# EasyEDA Pro project F405飞控工程文件（20250418）.epro, schematic Schematic1
Board Name: Board1; Create Date: 2024-08-31; Page Name: P1; Project Name: 低成本F405飞控; Schematic Name: Schematic1; Update Date: 2024-10-12; Company: 嘉立创EDA; Page Size: A4; Version: V1.0
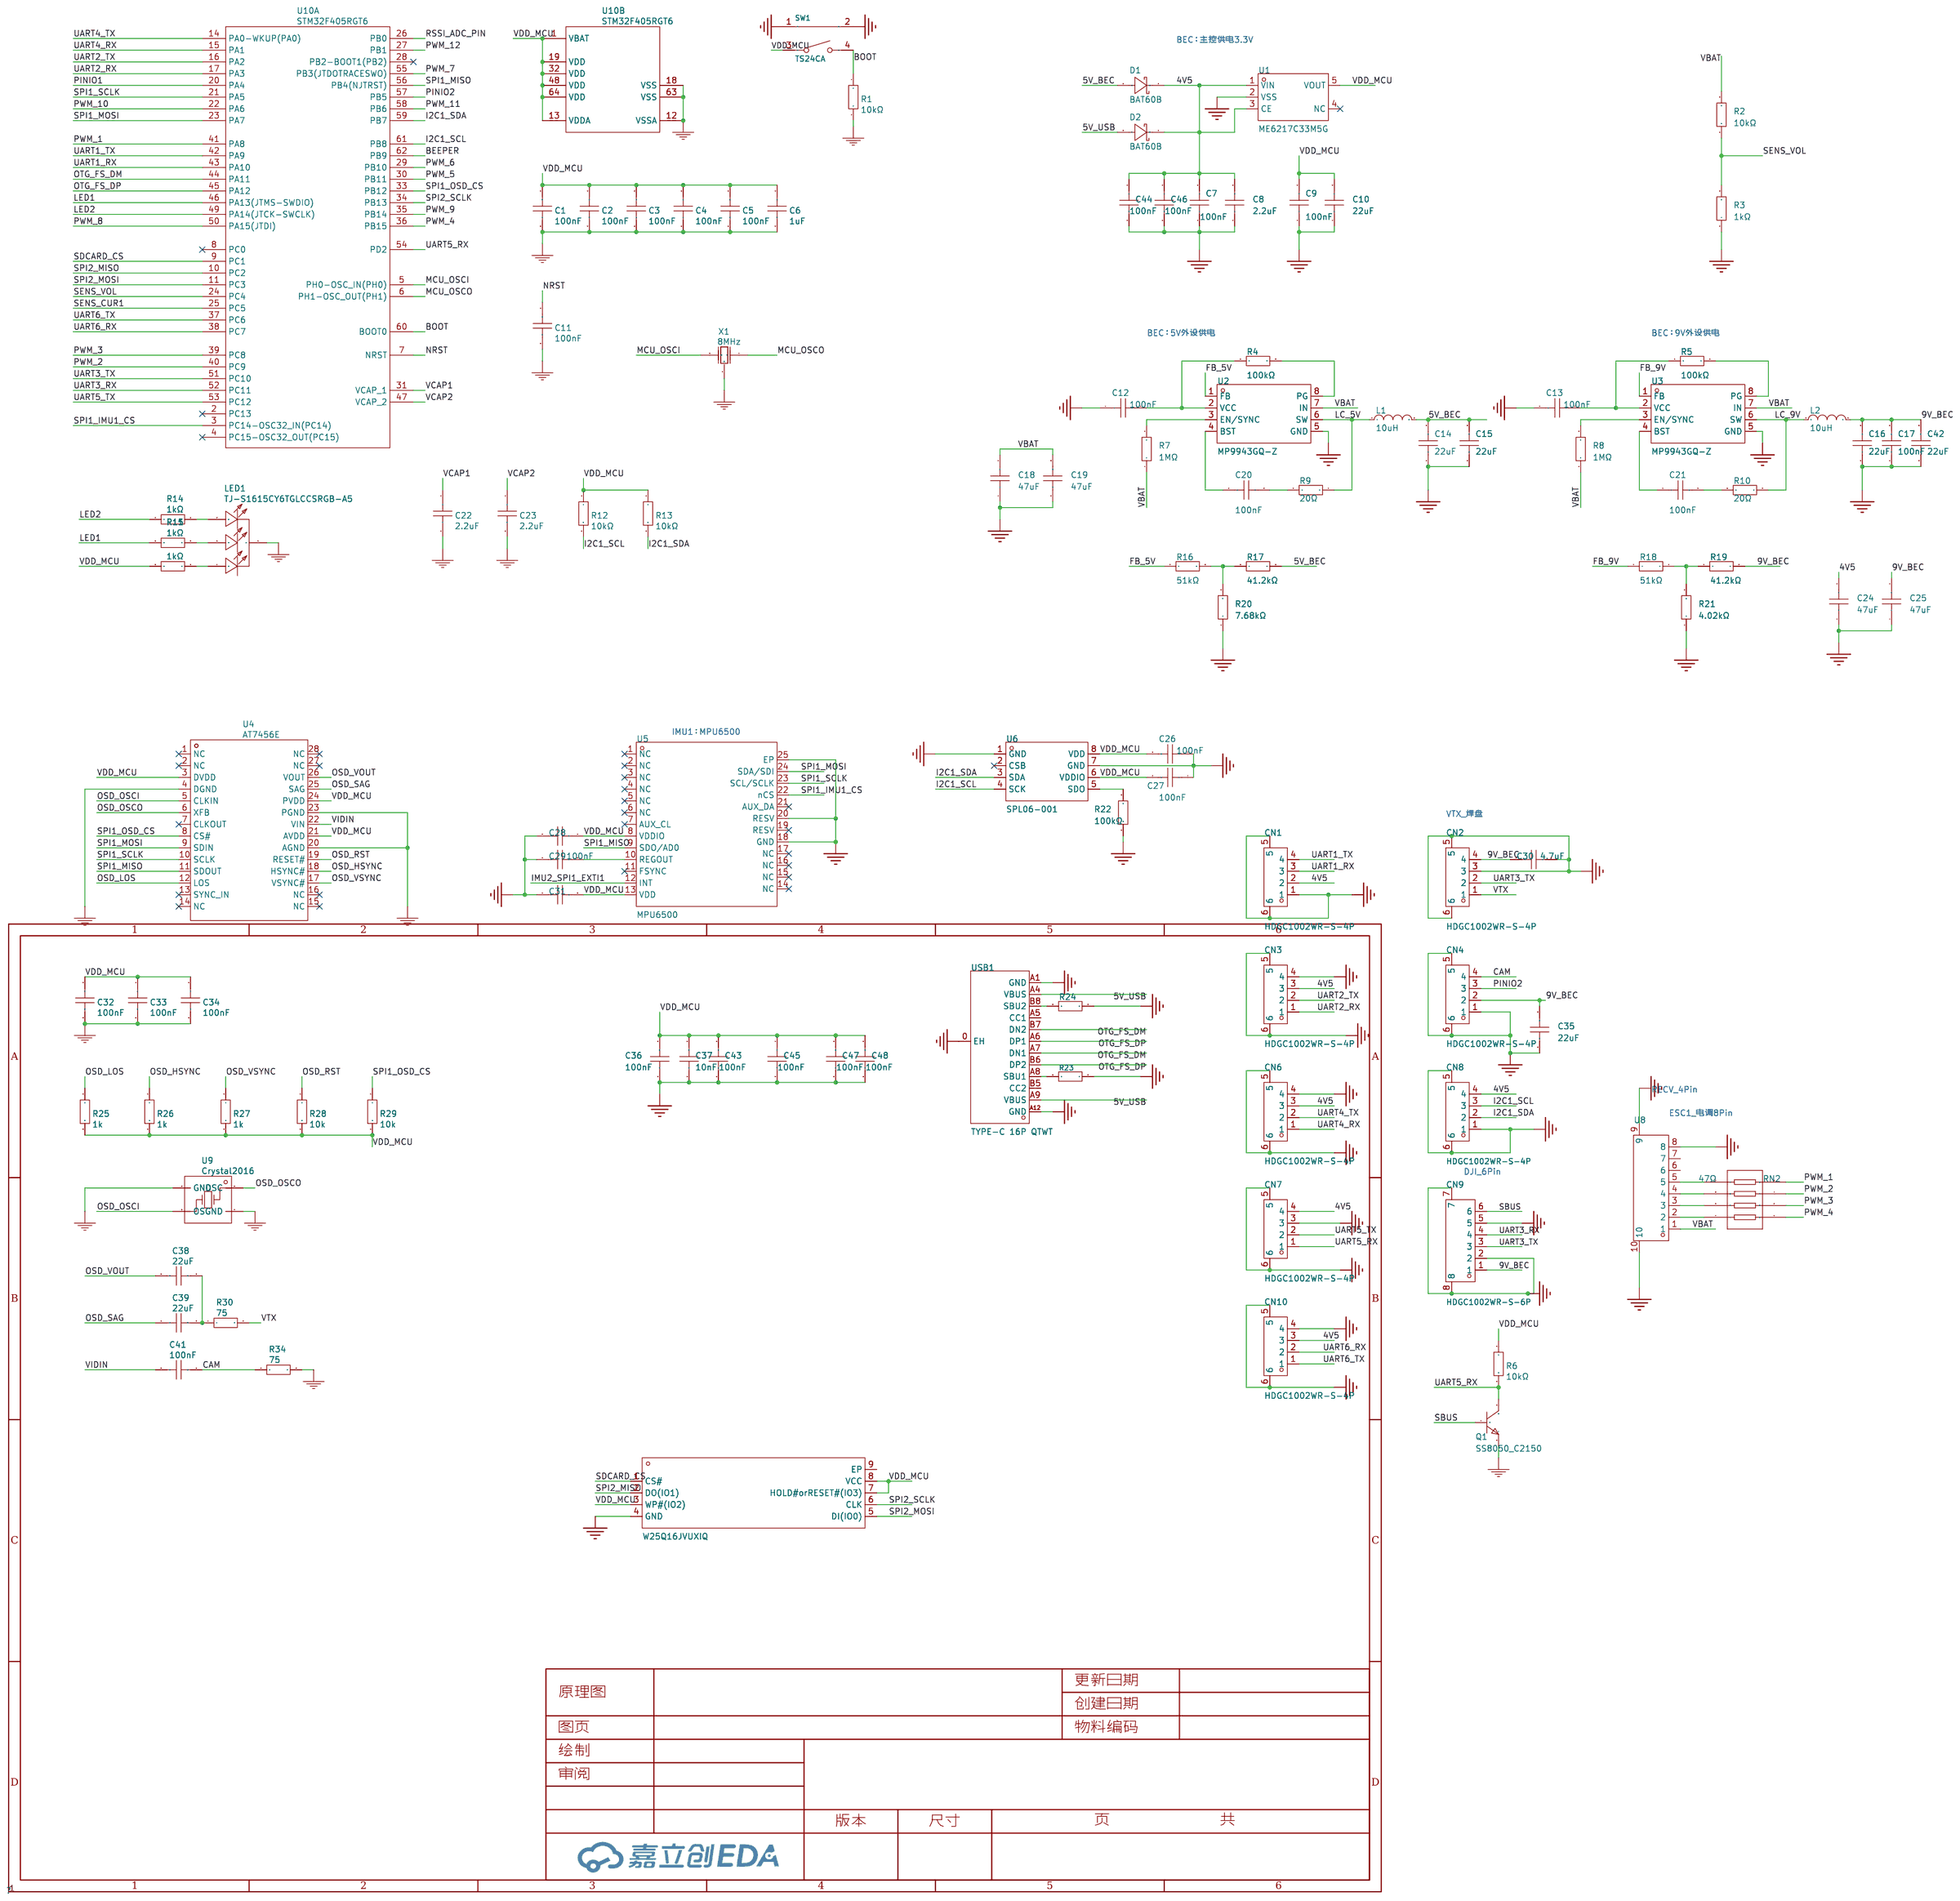
[diagram p0: schematic sheet]

## Parts
C1  100nF  [R0402]
C2  100nF  [R0402]
C3  100nF  [R0402]
C4  100nF  [R0402]
C5  100nF  [R0402]
C6  1uF  [R0402]
C7  100nF  [R0402]
C8  2.2uF  [R0402]
C9  100nF  [C0603]
C10  22uF  [C0603]
C11  100nF  [R0402]
C12  100nF  [C0402]
C13  100nF  [C0402]
C14  22uF  [C0603]
C15  22uF  [C0603]
C16  22uF  [C0603]
C17  100nF  [C0603]
C18  47uF  [C1206]
C19  47uF  [C1206]
C20  100nF  [C0402]
C21  100nF  [C0402]
C22  2.2uF  [R0402]
C23  2.2uF  [R0402]
C24  47uF  [C1206]
C25  47uF  [C1206]
C26  100nF  [C0402]
C27  100nF  [C0402]
C28  100nF  [C0402]
C29  100nF  [C0402]
C30  4.7uF  [C0603]
C31  100nF  [C0402]
C32  100nF  [C0402]
C33  100nF  [C0402]
C34  100nF  [C0402]
C35  22uF  [C0805]
C36  100nF  [C0402]
C37  10nF  [C0402]
C38  22uF  [C0402]
C39  22uF  [C0402]
C41  100nF  [C0402]
C42  22uF  [C0603]
C43  100nF  [R0402]
C44  100nF  [R0402]
C45  100nF  [R0402]
C46  100nF  [R0402]
C47  100nF  [R0402]
C48  100nF  [R0402]
CN1  HDGC1002WR-S-4P  [CONN-SMD_4P-P1.00_HDGC_HDGC1002WR-S-4P]
CN2  HDGC1002WR-S-4P  [CONN-SMD_4P-P1.00_HDGC_HDGC1002WR-S-4P]
CN3  HDGC1002WR-S-4P  [CONN-SMD_4P-P1.00_HDGC_HDGC1002WR-S-4P]
CN4  HDGC1002WR-S-4P  [CONN-SMD_4P-P1.00_HDGC_HDGC1002WR-S-4P]
CN6  HDGC1002WR-S-4P  [CONN-SMD_4P-P1.00_HDGC_HDGC1002WR-S-4P]
CN7  HDGC1002WR-S-4P  [CONN-SMD_4P-P1.00_HDGC_HDGC1002WR-S-4P]
CN8  HDGC1002WR-S-4P  [CONN-SMD_4P-P1.00_HDGC_HDGC1002WR-S-4P]
CN9  HDGC1002WR-S-6P  [CONN-SMD_6P-P1.00_HDGC1002WR-S-6P]
CN10  HDGC1002WR-S-4P  [CONN-SMD_4P-P1.00_HDGC_HDGC1002WR-S-4P]
D1  BAT60B  [SOD-323_L1.7-W1.3-LS2.6-RD-1]
D2  BAT60B  [SOD-323_L1.7-W1.3-LS2.6-RD-1]
L1  10uH  [IND-SMD_L4.4-W4.2]
L2  10uH  [IND-SMD_L4.4-W4.2]
LED1  TJ-S1615CY6TGLCCSRGB-A5  [LED-ARRAY-SMD_4P-L1.6-W1.5-BL-FD]
Q1  SS8050_C2150  [SOT-23-3_L2.9-W1.3-P1.90-LS2.4-BR]
R1  10kΩ  [R0402]
R2  10kΩ  [R0402]
R3  1kΩ  [R0402]
R4  100kΩ  [R0402]
R5  100kΩ  [R0402]
R6  10kΩ  [R0402]
R7  1MΩ  [R0402]
R8  1MΩ  [R0402]
R9  20Ω  [R0402]
R10  20Ω  [R0402]
R11  1kΩ  [R0402]
R12  10kΩ  [R0402]
R13  10kΩ  [R0402]
R14  1kΩ  [R0402]
R15  1kΩ  [R0402]
R16  51kΩ  [R0402]
R17  41.2kΩ  [R0402]
R18  51kΩ  [R0402]
R19  41.2kΩ  [R0402]
R20  7.68kΩ  [R0402]
R21  4.02kΩ  [R0402]
R22  100kΩ  [R0402]
R23  5.1kΩ  [R0402]
R24  5.1kΩ  [R0402]
R25  1k  [R0402]
R26  1k  [R0402]
R27  1k  [R0402]
R28  10k  [R0402]
R29  10k  [R0402]
R30  75  [R0402]
R34  75  [R0402]
RN2  47Ω  [RES-ARRAY-SMD_0402-8P-L2.0-W1.0-BL]
SW1  TS24CA  [SW-SMD_TS24CA]
U1  ME6217C33M5G  [SOT-23-5_L3.0-W1.7-P0.95-LS2.8-BR]
U2  MP9943GQ-Z  [QFN-8_L3.0-W3.0-P0.65-BL]
U3  MP9943GQ-Z  [QFN-8_L3.0-W3.0-P0.65-BL]
U4  AT7456E  [AT7456E-SHORTER-FOOTPRINT]
U5  MPU6500  [QFN-24_L3.0-W3.0-P0.40-BL-EP]
U6  SPL06-001  [SENSOR-SMD_SPL06-001]
U8  HDGC1002WR-S-8P  [CONN-SMD_8P-P1.00_HDGC_HDGC1002WR-S-8P]
U9  Crystal2016  [CRYSTAL2016]
U10  STM32F405RGT6  [LQFP-64_L10.0-W10.0-P0.50-LS12.0-BL]  (sections 1,2)
U11  W25Q16JVUXIQ  [USON-8_L3.0-W2.0-P0.50-BL-EP]
USB1  TYPE-C 16P QTWT  [USB-TYPE-C-SMD_TYPE-C-16P-QTWT]
X1  8MHz  [OSC-SMD_3P-L3.2-W1.3-P1.20-L]

## Library data of the parts
C1-C5 C11 C43-C48 = GRM155R71H104KE14D: 容值:100nF;精度:±10%;额定电压:50V;材质(温度系数):X7R;; LCSC Part Name: 100nF ±10% 50V; Supplier Part: C77020; Manufacturer: muRata(村田); Supplier Footprint: 0402; JLCPCB Part Class: Extended Part; Datasheet: https://atta.szlcsc.com/upload/public/pdf/source/20180326/C77020_39BD49C951FF1AF0DB1F1FAC5AC1E401.pdf; Supplier: LCSC; Tolerance: ±10%; Voltage Rated: 50V; Temperature Coefficient: X7R; 3DModel: C0402_L1.0-W0.5-H0.5
C6 = GRM155R61H105KE05D: 容值:1uF;精度:±10%;额定电压:50V;材质(温度系数):X5R;; LCSC Part Name: 1uF ±10% 50V; Supplier Part: C1518208; Manufacturer: muRata(村田); Supplier Footprint: 0402; JLCPCB Part Class: Extended Part; Datasheet: https://atta.szlcsc.com/upload/public/pdf/source/20210607/3F03D47137F6EC7729AB4067EB2A6EB3.pdf; Supplier: LCSC; Tolerance: ±10%; Voltage Rated: 50V; Temperature Coefficient: X5R; 3DModel: C0402_L1.0-W0.5-H0.5
C7 C12 C13 C20 C21 C26 C27 C29 C36 = GRM155R71H104KE14D: 容值:100nF;精度:±10%;额定电压:50V;材质(温度系数):X7R;; LCSC Part Name: 100nF ±10% 50V; Supplier Part: C77020; Manufacturer: muRata(村田); Supplier Footprint: 0402; JLCPCB Part Class: Extended Part; Datasheet: https://atta.szlcsc.com/upload/public/pdf/source/20180326/C77020_39BD49C951FF1AF0DB1F1FAC5AC1E401.pdf; Supplier: LCSC; Tolerance: ±10%; Voltage Rated: 50V; Temperature Coefficient: X7R
C8 = CGA0402X5R225K350GT: 容值:2.2uF;精度:±10%;额定电压:35V;材质(温度系数):X5R;; LCSC Part Name: 2.2uF ±10% 35V; Supplier Part: C6119793; Manufacturer: HRE(芯声); Supplier Footprint: 0402; JLCPCB Part Class: Extended Part; Datasheet: https://atta.szlcsc.com/upload/public/pdf/source/20160218/1457707763339.pdf; Supplier: LCSC; Tolerance: ±10%; Voltage Rated: 35V; Temperature Coefficient: X5R
C9 C17 = 0603B104K500NT: 容值:100nF;精度:±10%;额定电压:50V;材质(温度系数):X7R;; LCSC Part Name: 100nF ±10% 50V; Supplier Part: C30926; Manufacturer: FH(风华); Supplier Footprint: 0603; JLCPCB Part Class: Extended Part; Datasheet: https://atta.szlcsc.com/upload/public/pdf/source/20200305/C486355_26A10D38EF8C2A5C37091D0039909270.pdf; Supplier: LCSC; Tolerance: ±10%; Voltage Rated: 50V; Temperature Coefficient: X7R
C10 C14-C16 C42 = CL10A226MQ8NRNC: 容值:22uF;精度:±20%;额定电压:6.3V;材质(温度系数):X5R;; LCSC Part Name: 22uF ±20% 6.3V; Supplier Part: C59461; Manufacturer: SAMSUNG(三星); Supplier Footprint: 0603; JLCPCB Part Class: Basic Part; Datasheet: https://atta.szlcsc.com/upload/public/pdf/source/20160218/1457707763339.pdf; Supplier: LCSC; Tolerance: ±20%; Voltage Rated: 6.3V; Temperature Coefficient: X5R
C18 C19 C24 C25 = CL31A476MPHNNNE: 容值:47uF;精度:±20%;额定电压:10V;材质(温度系数):X5R;; LCSC Part Name: 47uF ±20% 10V; Supplier Part: C96123; Manufacturer: SAMSUNG(三星); Supplier Footprint: 1206; JLCPCB Part Class: Basic Part; Datasheet: https://atta.szlcsc.com/upload/public/pdf/source/20170228/1488267692219.pdf; Supplier: LCSC; Tolerance: ±20%; Voltage Rated: 10V; Temperature Coefficient: X5R
C22 C23 = CGA0402X5R225K350GT: 容值:2.2uF;精度:±10%;额定电压:35V;材质(温度系数):X5R;; LCSC Part Name: 2.2uF ±10% 35V; Supplier Part: C6119793; Manufacturer: HRE(芯声); Supplier Footprint: 0402; JLCPCB Part Class: Extended Part; Supplier: LCSC; Tolerance: ±10%; Voltage Rated: 35V; Temperature Coefficient: X5R; 3DModel: C0402_L1.0-W0.5-H0.5
C28 C31 = GRM155R71H104KE14D: 容值:100nF;精度:±10%;额定电压:50V;材质(温度系数):X7R;; LCSC Part Name: 100nF ±10% 50V; Supplier Part: C77020; Manufacturer: muRata(村田); Supplier Footprint: 0402; JLCPCB Part Class: Extended Part; Datasheet: https://atta.szlcsc.com/upload/public/pdf/source/20180326/C77020_39BD49C951FF1AF0DB1F1FAC5AC1E401.pdf; Supplier: LCSC; Tolerance: ±10%; Voltage Rated: 50V; Temperature Coefficient: X7R; link: https://item.szlcsc.com/15869.html; 3DModel: C0402_L1.0-W0.5-H0.5
C30 = CAP_0603: Supplier Footprint: 0603
C32-C34 C41 = 100nF: 3DModel: C0402_L1.0-W0.5-H0.5
C35 = CL21A226MAYNNNE: 容值:22uF;精度:±20%;额定电压:25V;材质(温度系数):X5R;; LCSC Part Name: 22uF ±20% 25V; Supplier Part: C602037; Manufacturer: SAMSUNG(三星); Supplier Footprint: 0805; JLCPCB Part Class: Extended Part; Datasheet: https://atta.szlcsc.com/upload/public/pdf/source/20200609/C602037_1A0D619693E608A1BF6E80154254E2DB.pdf; Supplier: LCSC; Tolerance: ±20%; Voltage Rated: 25V; Temperature Coefficient: X5R; Origin Footprint 2: 0805C
C37 = CC0402KRX7R9BB103: 容值:10nF;精度:±10%;额定电压:50V;材质(温度系数):X7R;; LCSC Part Name: 10nF ±10% 50V; Supplier Part: C60133; Manufacturer: YAGEO(国巨); Supplier Footprint: 0402; JLCPCB Part Class: Extended Part; Datasheet: https://atta.szlcsc.com/upload/public/pdf/source/20180224/C181747_15194369449651363981.pdf; Supplier: LCSC; Tolerance: ±10%; Voltage Rated: 50V; Temperature Coefficient: X7R
C38 C39 = CGA0402X5R226M100GT: 容值:22uF;精度:±20%;额定电压:10V;材质(温度系数):X5R;; LCSC Part Name: 22uF ±20% 10V; Supplier Part: C6119813; Manufacturer: HRE(芯声); Supplier Footprint: 0402; JLCPCB Part Class: Extended Part; Supplier: LCSC; Tolerance: ±20%; Voltage Rated: 10V; Temperature Coefficient: X5R; 3DModel: C0603_L1.6-W0.8-H0.8
CN1-CN4 CN6-CN8 CN10 = HDGC1002WR-S-4P: SH1.0针座卧贴 4P; LCSC Part Name: SH1.0针座卧贴 4P; Supplier Part: C2936214; Manufacturer: HDGC(华德共创); Supplier Footprint: SMD,P=1mm; JLCPCB Part Class: 扩展库; Datasheet: https://atta.szlcsc.com/upload/public/pdf/source/20211229/E8A09E85670B5E97244D2008A24D97FE.pdf; Supplier: LCSC
CN9 = HDGC1002WR-S-6P: 参考系列:SH;间距:1mm;排数:1;每排PIN数:6;公母:公型插针;安装方式:卧贴;额定电流:1A;工作温度范围:-40℃~+85℃;; LCSC Part Name: SH 1mm 卧贴; Supplier Part: C3041141; Manufacturer: HDGC(华德共创); Supplier Footprint: SMD,P=1mm; JLCPCB Part Class: 扩展库; Datasheet: https://atta.szlcsc.com/upload/public/pdf/source/20220621/C2AA6A1A2A279F73FC0521BA202CB6E2.pdf; Supplier: LCSC; Reference Series: SH; Pitch: 1mm; Number of Rows: 1; Number of PINs Per Row: 6; Gender: 公型插针; Mounting Style: 卧贴; Current Rating (Max): 1A; Operating Temperature Range: -40℃~+85℃
D1 = BAT60B_C7502695: 二极管配置:独立式;正向压降(Vf):600mV@1A;直流反向耐压(Vr):10V;整流电流:3A;; LCSC Part Name: 电压:10V 电流:3A; Supplier Part: C7502695; Manufacturer: 宏迦橙; Supplier Footprint: SOD-323; JLCPCB Part Class: Extended Part; Datasheet: https://atta.szlcsc.com/upload/public/pdf/source/20230828/25AE167151E881636AF68D9C9ECB5F9C.pdf; Supplier: LCSC; Diode Configuration: 独立式; Forward Voltage (Vf@If): 600mV@1A; Reverse Voltage (Vr): 10V; Rectified Current: 3A; Reverse Leakage Current (Ir): 25uA
D2 = BAT60B_C7502695: 二极管配置:独立式;正向压降(Vf):600mV@1A;直流反向耐压(Vr):10V;整流电流:3A;; LCSC Part Name: 电压:10V 电流:3A; Supplier Part: C7502695; Manufacturer: 宏迦橙; Supplier Footprint: SOD-323; JLCPCB Part Class: Extended Part; Datasheet: https://atta.szlcsc.com/upload/public/pdf/source/20230828/25AE167151E881636AF68D9C9ECB5F9C.pdf; Supplier: LCSC; Diode Configuration: 独立式; Forward Voltage (Vf@If): 600mV@1A; Reverse Voltage (Vr): 10V; Rectified Current: 3A; Reverse Leakage Current (Ir): 25uA; Average Rectified Current (Io): 3A
L1 L2 = FXL0420-100-M: 电感值:10uH;精度:±20%;额定电流:1.6A;饱和电流(Isat):2.2A;类型:一体成型电感;; LCSC Part Name: 10uH ±20% 2.2A; Supplier Part: C177242; Manufacturer: cjiang(长江微电); Supplier Footprint: SMD,4.2x4.4mm; JLCPCB Part Class: Extended Part; Datasheet: https://atta.szlcsc.com/upload/public/pdf/source/20200117/C485363_A2440626DC7482D75DD0DD56D1883FBF.pdf; Supplier: LCSC; Tolerance: ±20%; Rated Current: 1.6A; Saturation Current (Isat): 2.2A; DC Resistance (DCR): 282mΩ; Type: 一体成型电感
LED1 = TJ-S1615CY6TGLCCSRGB-A5: link: https://item.szlcsc.com/261955.html; 3DModel: LED-ARRAY-SMD_4P-L1.6-W1.5-H0.6-BL-FD; Supplier: LCSC; Supplier Part: C601684; Manufacturer: TOGIALED; JLCPCB Part Class: Extended Part
Q1 = SS8050_C2150: link: https://www.diodes.com/assets/Package-Files/SOT23.pdf; 3DModel: SOT-23-3P_L2.9-W1.3-H1.0-LS2.4-P0.95; Supplier: LCSC; Manufacturer: CJ; Manufacturer Part: SS8050; Supplier Part: C2150; JLCPCB Part Class: Basic Part
R1 R6 R12 R13 = RC0402FR-0710KL: 电阻类型:厚膜电阻;阻值:10kΩ;精度:±1%;功率:62.5mW;最大工作电压:50V;温度系数:±100ppm/℃;; LCSC Part Name: 厚膜电阻 10kΩ ±1% 62.5mW; Supplier Part: C60490; Manufacturer: YAGEO(国巨); Supplier Footprint: 0402; JLCPCB Part Class: Extended Part; Datasheet: https://atta.szlcsc.com/upload/public/pdf/source/20170925/C131467_1506321478108990263.pdf; Supplier: LCSC; Type: 厚膜电阻; Tolerance: ±1%; Power(Watts): 62.5mW; Overload Voltage (Max): 50V; Temperature Coefficient: ±100ppm/℃; Operating Temperature Range: -55℃~+155℃; 3DModel: R0402_L1.0-W0.5-H0.4
R2 = RC0402FR-0710KL: 电阻类型:厚膜电阻;阻值:10kΩ;精度:±1%;功率:62.5mW;最大工作电压:50V;温度系数:±100ppm/℃;; LCSC Part Name: 厚膜电阻 10kΩ ±1% 62.5mW; Supplier Part: C60490; Manufacturer: YAGEO(国巨); Supplier Footprint: 0402; JLCPCB Part Class: Extended Part; Datasheet: https://atta.szlcsc.com/upload/public/pdf/source/20170925/C131467_1506321478108990263.pdf; Supplier: LCSC; Type: 厚膜电阻; Tolerance: ±1%; Power(Watts): 62.5mW; Overload Voltage (Max): 50V; Temperature Coefficient: ±100ppm/℃; Operating Temperature Range: -55℃~+155℃
R3 = 0402WGF1001TCE: 电阻类型:厚膜电阻;阻值:1kΩ;精度:±1%;功率:62.5mW;最大工作电压:50V;温度系数:±100ppm/℃;; LCSC Part Name: 1kΩ ±1% 62.5mW 厚膜电阻; Supplier Part: C11702; Manufacturer: UNI-ROYAL(厚声); Supplier Footprint: 0402; JLCPCB Part Class: Basic Part; Datasheet: https://atta.szlcsc.com/upload/public/pdf/source/20200306/C422600_1E6D84923E4A46A82E41ADD87F860B5C.pdf; Supplier: LCSC; Type: 厚膜电阻; Tolerance: ±1%; Power(Watts): 62.5mW; Overload Voltage (Max): 50V; Temperature Coefficient: ±100ppm/℃; Operating Temperature Range: -55℃~+155℃
R4 R5 R22 = RC0402FR-07100KL: 电阻类型:厚膜电阻;阻值:100kΩ;精度:±1%;功率:62.5mW;最大工作电压:50V;温度系数:±100ppm/℃;; LCSC Part Name: 厚膜电阻 100kΩ ±1% 62.5mW; Supplier Part: C60491; Manufacturer: YAGEO(国巨); Supplier Footprint: 0402; JLCPCB Part Class: Extended Part; Datasheet: https://atta.szlcsc.com/upload/public/pdf/source/20180927/C295883_E8D83085EA81BD7DE0B2B681138C15EE.pdf; Supplier: LCSC; Type: 厚膜电阻; Tolerance: ±1%; Power(Watts): 62.5mW; Overload Voltage (Max): 50V; Temperature Coefficient: ±100ppm/℃; Operating Temperature Range: -55℃~+155℃
R7 R8 = 0402WGF1004TCE: 电阻类型:厚膜电阻;阻值:1MΩ;精度:±1%;功率:62.5mW;最大工作电压:50V;温度系数:±100ppm/℃;; LCSC Part Name: 1MΩ ±1% 62.5mW 厚膜电阻; Supplier Part: C26083; Manufacturer: UNI-ROYAL(厚声); Supplier Footprint: 0402; JLCPCB Part Class: Basic Part; Datasheet: https://atta.szlcsc.com/upload/public/pdf/source/20200306/C422600_1E6D84923E4A46A82E41ADD87F860B5C.pdf; Supplier: LCSC; Type: 厚膜电阻; Tolerance: ±1%; Power(Watts): 62.5mW; Overload Voltage (Max): 50V; Temperature Coefficient: ±100ppm/℃; Operating Temperature Range: -55℃~+155℃
R9 R10 = 0402WGF200JTCE: 电阻类型:厚膜电阻;阻值:20Ω;精度:±1%;功率:62.5mW;最大工作电压:50V;温度系数:±200ppm/℃;; LCSC Part Name: 20Ω ±1% 62.5mW 厚膜电阻; Supplier Part: C25089; Manufacturer: UNI-ROYAL(厚声); Supplier Footprint: 0402; JLCPCB Part Class: Extended Part; Datasheet: https://atta.szlcsc.com/upload/public/pdf/source/20200306/C422600_1E6D84923E4A46A82E41ADD87F860B5C.pdf; Supplier: LCSC; Type: 厚膜电阻; Tolerance: ±1%; Power(Watts): 62.5mW; Overload Voltage (Max): 50V; Temperature Coefficient: ±200ppm/℃; Operating Temperature Range: -55℃~+155℃
R11 R14 R15 = 0402WGF1001TCE: 电阻类型:厚膜电阻;阻值:1kΩ;精度:±1%;功率:62.5mW;最大工作电压:50V;温度系数:±100ppm/℃;; LCSC Part Name: 1kΩ ±1% 62.5mW 厚膜电阻; Supplier Part: C11702; Manufacturer: UNI-ROYAL(厚声); Supplier Footprint: 0402; JLCPCB Part Class: Basic Part; Datasheet: https://atta.szlcsc.com/upload/public/pdf/source/20200306/C422600_1E6D84923E4A46A82E41ADD87F860B5C.pdf; Supplier: LCSC; Type: 厚膜电阻; Tolerance: ±1%; Power(Watts): 62.5mW; Overload Voltage (Max): 50V; Temperature Coefficient: ±100ppm/℃; Operating Temperature Range: -55℃~+155℃; 3DModel: R0402_L1.0-W0.5-H0.4
R16 R18 = 0402WGF5102TCE: 电阻类型:厚膜电阻;阻值:51kΩ;精度:±1%;功率:62.5mW;最大工作电压:50V;温度系数:±100ppm/℃;; LCSC Part Name: 51kΩ ±1% 62.5mW 厚膜电阻; Supplier Part: C25794; Manufacturer: UNI-ROYAL(厚声); Supplier Footprint: 0402; JLCPCB Part Class: Basic Part; Datasheet: https://atta.szlcsc.com/upload/public/pdf/source/20200306/C422600_1E6D84923E4A46A82E41ADD87F860B5C.pdf; Supplier: LCSC; Type: 厚膜电阻; Tolerance: ±1%; Power(Watts): 62.5mW; Overload Voltage (Max): 50V; Temperature Coefficient: ±100ppm/℃; Operating Temperature Range: -55℃~+155℃
R17 R19 = 0402WGF4122TCE: 电阻类型:厚膜电阻;阻值:41.2kΩ;精度:±1%;功率:62.5mW;最大工作电压:50V;温度系数:±100ppm/℃;; LCSC Part Name: 41.2kΩ ±1% 62.5mW 厚膜电阻; Supplier Part: C26978; Manufacturer: UNI-ROYAL(厚声); Supplier Footprint: 0402; JLCPCB Part Class: Extended Part; Datasheet: https://atta.szlcsc.com/upload/public/pdf/source/20200306/C422600_1E6D84923E4A46A82E41ADD87F860B5C.pdf; Supplier: LCSC; Type: 厚膜电阻; Tolerance: ±1%; Power(Watts): 62.5mW; Overload Voltage (Max): 50V; Temperature Coefficient: ±100ppm/℃; Operating Temperature Range: -55℃~+155℃
R20 = 0402WGF7681TCE: 电阻类型:厚膜电阻;阻值:7.68kΩ;精度:±1%;功率:62.5mW;最大工作电压:50V;温度系数:±100ppm/℃;; LCSC Part Name: 7.68kΩ ±1% 62.5mW 厚膜电阻; Supplier Part: C25919; Manufacturer: UNI-ROYAL(厚声); Supplier Footprint: 0402; JLCPCB Part Class: Extended Part; Datasheet: https://atta.szlcsc.com/upload/public/pdf/source/20200306/C422600_1E6D84923E4A46A82E41ADD87F860B5C.pdf; Supplier: LCSC; Type: 厚膜电阻; Tolerance: ±1%; Power(Watts): 62.5mW; Overload Voltage (Max): 50V; Temperature Coefficient: ±100ppm/℃; Operating Temperature Range: -55℃~+155℃
R21 = 0402WGF4021TCE: 电阻类型:厚膜电阻;阻值:4.02kΩ;精度:±1%;功率:62.5mW;最大工作电压:50V;温度系数:±100ppm/℃;; LCSC Part Name: 4.02kΩ ±1% 62.5mW 厚膜电阻; Supplier Part: C43251; Manufacturer: UNI-ROYAL(厚声); Supplier Footprint: 0402; JLCPCB Part Class: Extended Part; Datasheet: https://atta.szlcsc.com/upload/public/pdf/source/20200306/C422600_1E6D84923E4A46A82E41ADD87F860B5C.pdf; Supplier: LCSC; Type: 厚膜电阻; Tolerance: ±1%; Power(Watts): 62.5mW; Overload Voltage (Max): 50V; Temperature Coefficient: ±100ppm/℃; Operating Temperature Range: -55℃~+155℃
R23 R24 = 0402WGF5101TCE: 电阻类型:厚膜电阻;阻值:5.1kΩ;精度:±1%;功率:62.5mW;最大工作电压:50V;温度系数:±100ppm/℃;; LCSC Part Name: 5.1kΩ ±1% 62.5mW 厚膜电阻; Supplier Part: C25905; Manufacturer: UNI-ROYAL(厚声); Supplier Footprint: 0402; JLCPCB Part Class: Basic Part; Datasheet: https://atta.szlcsc.com/upload/public/pdf/source/20200306/C422600_1E6D84923E4A46A82E41ADD87F860B5C.pdf; Supplier: LCSC; Type: 厚膜电阻; Tolerance: ±1%; Power(Watts): 62.5mW; Overload Voltage (Max): 50V; Temperature Coefficient: ±100ppm/℃; Operating Temperature Range: -55℃~+155℃; link: https://item.szlcsc.com/323315.html; 3DModel: R0402_L1.0-W0.5-H0.5; Resistance: 5.1K; Standardization Check: true
R25-R27 = 1k: 3DModel: R0402_L1.0-W0.5-H0.4; Supplier: LCSC
R28 R29 = 10k: 3DModel: R0402_L1.0-W0.5-H0.4; Supplier: LCSC
R30 R34 = 75: 3DModel: R0402_L1.0-W0.5-H0.4; Supplier: LCSC
RN2 = AF124-JR-0747RL: 电阻器数:4;阻值:47Ω;精度:±5%;单个元件功率:62.5mW;温度系数:±200ppm/℃;; LCSC Part Name: 47Ω ±5% 0402x4; Supplier Part: C723467; Manufacturer: YAGEO(国巨); Supplier Footprint: 0402x4; JLCPCB Part Class: Extended Part; Datasheet: https://atta.szlcsc.com/upload/public/pdf/source/20200817/C723467_726CADB538F6405BDC12AAE9A767035C.pdf; Supplier: LCSC; Number of Resistors: 4; Tolerance: ±5%; Power(Watts): 62.5mW; Temperature Coefficient: ±200ppm/℃; Number of Pins: 8
SW1 = TS24CA: 触点电流:50mA;额定电压(DC):12V;电路结构:单刀单掷;安装方式:卧贴;带灯:-;机械寿命:-;; LCSC Part Name: 4.55*1.8*3.5mm 卧贴 轻触开关; Supplier Part: C393942; Manufacturer: SHOU HAN(首韩); Supplier Footprint: SMD; JLCPCB Part Class: 扩展库; Datasheet: https://atta.szlcsc.com/upload/public/pdf/source/20190521/C393942_591A9E318887EFA4274D34029981AD99.pdf; Supplier: LCSC; Contact Current: 50mA; Voltage Rating (DC): 12V; Circuit: 单刀单掷; Mounting Style: 卧贴; Actuator Style: 矩形按钮; Switch Length: 4.55mm; Switch Width: 1.8mm; Switch Height: 3.5mm
U1 = ME6217C33M5G: 输出类型:固定;输出极性:正;最大输入电压:7V;输出电压:3.3V;输出电流:800mA;电源纹波抑制比(PSRR):65dB@(1kHz);; Supplier Part: C427602; Manufacturer: MICRONE(南京微盟); Supplier Footprint: SOT-23-5; JLCPCB Part Class: 扩展库; Datasheet: https://atta.szlcsc.com/upload/public/pdf/source/20190910/C427602_D4B9162A2E9D9EF57C60010DFDECEF37.pdf; Supplier: LCSC; Output Type: 固定; Output Polarity: 正; Number of Outputs: 1; Maximum Input Voltage: 7V; Output Voltage: 3.3V; Dropout Voltage: 180mV@(300mA); Output Current: 800mA; Power Supply Rejection Ratio (PSRR): 65dB@(1kHz)
U2 U3 = MP9943GQ-Z: Supplier Part: C477821; Supplier Footprint: QFN-8_3x3mm; JLCPCB Part Class: 扩展库; Datasheet: 2021-05-22/374398S/94eb60b6438e46f987ac1f72df989e4b/MP9943.pdf; Supplier: LCSC; Standardization Check: true
U4 = AT7456E: 3DModel: HTSSOP-28_L9.7-W4.4-P0.65-LS6.4-BL-EP-2
U5 = MPU6500: Accelerometer, Gyroscope, 3 Axis Sensor I2C, SPI Output; Supplier Part: C50278; Manufacturer: TDK InvenSense(应美盛); Supplier Footprint: QFN-24-EP(3x3); JLCPCB Part Class: 扩展库; Datasheet: https://atta.szlcsc.com/upload/public/pdf/source/20170505/1493957890595.pdf; Supplier: LCSC; Standardization Check: true
U6 = SPL06-001_C2684428: LCSC Part Name: 普通气压传感器; Supplier Part: C2684428; Manufacturer: Goertek(歌尔); Supplier Footprint: SMD-8P,2x2.5mm; JLCPCB Part Class: 扩展库; Datasheet: https://atta.szlcsc.com/upload/public/pdf/source/20210120/C2684428_7EA58BBCA3793458F617124FBE4BF8F1.pdf; Supplier: LCSC
U8 = HDGC1002WR-S-8P: 参考系列:SH;间距:1mm;排数:1;每排PIN数:8;公母:公型插针;安装方式:卧贴;额定电流:1A;工作温度范围:-40℃~+85℃;; LCSC Part Name: SH 1mm 卧贴; Supplier Part: C3041142; Manufacturer: HDGC(华德共创); Supplier Footprint: SMD,P=1mm; JLCPCB Part Class: 扩展库; Datasheet: https://atta.szlcsc.com/upload/public/pdf/source/20220621/C2AA6A1A2A279F73FC0521BA202CB6E2.pdf; Supplier: LCSC; Reference Series: SH; Pitch: 1mm; Number of Rows: 1; Number of PINs Per Row: 8; Gender: 公型插针; Mounting Style: 卧贴; Current Rating (Max): 1A; Operating Temperature Range: -40℃~+85℃
U9 = Crystal2016: 3DModel: OSC-SMD_4P-L2.0-W1.6-BL_X201624MKB4SI
U10 = STM32F405RGT6: link: https://item.szlcsc.com/92458.html; 3DModel: LQFP-64_L10.0-W10.0-H1.4-LS12.0-P0.50; tags: STM32; Supplier Part: C15742; Supplier: LCSC; Manufacturer: ST; image: http://image.lceda.cn/szlcsc/C15742.jpg; JLCPCB Part Class: Extended Part
U11 = W25Q16JVUXIQ: Supplier Part: C2843335; Manufacturer: WINBOND(华邦); Supplier Footprint: USON-8-EP(2x3); JLCPCB Part Class: 扩展库; Datasheet: https://atta.szlcsc.com/upload/public/pdf/source/20210629/C2843335_FB4D78B5076715625DC0C83F790D3044.pdf; Supplier: LCSC
USB1 = TYPE-C 16P QTWT: 连接器类型:Type-C;标准:-;公母:母;端口数量:1;触点数量:16P;安装方式:卧贴;额定电流 - 电源:3A;触头材质:-;触头镀层:-;工作温度范围:-25℃~+85℃;焊接温度(最大值):-;; LCSC Part Name: Type-C 母 卧贴; Supplier Part: C5187472; Manufacturer: SHOU HAN(首韩); Supplier Footprint: SMD; JLCPCB Part Class: 扩展库; Datasheet: https://atta.szlcsc.com/upload/public/pdf/source/20220929/9CA39B32C19F2C1116A695DA9353B6B2.pdf; Supplier: LCSC; Connector Type: Type-C; Gender: 母; Number of Ports: 1; Number of Contacts: 16P; Mounting Style: 卧贴; Current Rating - Power (Max): 3A; Operating Temperature Range: -25℃~+85℃
X1 = 8MHz: link: https://item.szlcsc.com/318914.html; 3DModel: OSC-SMD_3P-L3.2-W1.3-H0.8-P1.2; Supplier: LCSC; Supplier Part: C341524; Manufacturer: Murata Electronics; Manufacturer Part: CSTNE8M00G55Z000R0; JLCPCB Part Class: Extended Part

## Nets
4V5: C7.2 C8.2 C24.2 C44.1 C46.1 CN1.2 CN3.3 CN6.3 CN7.4 CN8.4 CN10.3 D1.1(C) D2.1(C) U1.1(VIN) U1.3(CE)
5V_BEC: C14.2 C15.2 D1.2(A) L1.2 R17.2
5V_USB: D2.2(A) USB1.A4(VBUS) USB1.A9(VBUS)
9V_BEC: C16.2 C17.2 C25.2 C30.1 C35.2 C42.2 CN2.4 CN4.2 CN9.1 L2.2 R19.2
GND: C1.2 C2.2 C3.2 C4.2 C5.2 C6.2 C7.1 C8.1 C9.1 C10.1 C11.2 C12.1 C13.1 C14.1 C15.1 C16.1 C17.1 C18.1 C19.1 C22.2 C23.2 C24.1 C25.1 C26.1 C27.1 C28.2 C29.1 C30.2 C31.1 C32.2 C33.2 C34.2 C35.1 C36.1 C37.1 C42.1 C43.2 C44.2 C45.2 C46.2 C47.2 C48.2 CN1.1 CN1.5 CN1.6 CN2.3 CN2.5 CN2.6 CN3.4 CN3.5 CN3.6 CN4.1 CN4.5 CN4.6 CN6.4 CN6.5 CN6.6 CN7.3 CN7.5 CN7.6 CN8.1 CN8.5 CN8.6 CN9.2 CN9.5 CN9.7 CN9.8 CN10.4 CN10.5 CN10.6 LED1.1(C) Q1.2(E) R1.2 R3.1 R20.1 R21.1 R22.1 R23.1 R24.1 R34.2 SW1.1 SW1.2 U1.2(VSS) U2.5(GND) U3.5(GND) U4.4(DGND) U4.20(AGND) U4.23(PGND) U5.18(GND) U5.20(RESV) U5.25(EP) U6.1(GND) U6.7(GND) U8.8 U8.9 U8.10 U9.2(GND) U9.4(GND) U10.12(VSSA) U10.18(VSS) U10.63(VSS) U11.4(GND) USB1.0(EH) USB1.A1(GND) USB1.A12(GND) X1.2(GND)
VBAT: C18.2 C19.2 R2.2 R7.1 R8.1 U2.7(IN) U3.7(IN) U8.1
VDD_MCU: C1.1 C2.1 C3.1 C4.1 C5.1 C6.1 C9.2 C10.2 C26.2 C27.2 C28.1 C31.2 C32.1 C33.1 C34.1 C36.2 C37.2 C43.1 C45.1 C47.1 C48.1 R6.1 R12.1 R13.1 R15.1 R25.2 R26.2 R27.2 R28.2 R29.2 SW1.3 U1.5(VOUT) U4.3(DVDD) U4.21(AVDD) U4.24(PVDD) U5.8(VDDIO) U5.13(VDD) U6.6(VDDIO) U6.8(VDD) U10.1(VBAT) U10.13(VDDA) U10.19(VDD) U10.32(VDD) U10.48(VDD) U10.64(VDD) U11.3(WP#(IO2)) U11.7(HOLD#orRESET#(IO3)) U11.8(VCC)
BEEPER: U10.62(PB9)
BOOT: R1.1 SW1.4 U10.60(BOOT0)
CAM: C41.2 CN4.4 R34.1
FB_5V: R16.1 U2.1(FB)
FB_9V: R18.1 U3.1(FB)
I2C1_SCL: CN8.3 R12.2 U6.4(SCK) U10.61(PB8)
I2C1_SDA: CN8.2 R13.2 U6.3(SDA) U10.59(PB7)
IMU2_SPI1_EXTI1: U5.12(INT)
LC_5V: L1.1 R9.1 U2.6(SW)
LC_9V: L2.1 R10.1 U3.6(SW)
LED1: R11.1 U10.46(PA13(JTMS-SWDIO))
LED2: R14.1 U10.49(PA14(JTCK-SWCLK))
MCU_OSCI: U10.5(PH0-OSC_IN(PH0)) X1.3(OSC2)
MCU_OSCO: U10.6(PH1-OSC_OUT(PH1)) X1.1(OSC1)
NRST: C11.1 U10.7(NRST)
OSD_HSYNC: R26.1 U4.18(HSYNC#)
OSD_LOS: R25.1 U4.12(LOS)
OSD_OSCI: U4.5(CLKIN) U9.3(OSC)
OSD_OSCO: U4.6(XFB) U9.1(OSC)
OSD_RST: R28.1 U4.19(RESET#)
OSD_SAG: C39.1 U4.25(SAG)
OSD_VOUT: C38.1 U4.26(VOUT)
OSD_VSYNC: R27.1 U4.17(VSYNC#)
OTG_FS_DM: U10.44(PA11) USB1.A7(DN1) USB1.B7(DN2)
OTG_FS_DP: U10.45(PA12) USB1.A6(DP1) USB1.B6(DP2)
PINIO1: U10.20(PA4)
PINIO2: CN4.3 U10.57(PB5)
PWM_1: RN2.8 U10.41(PA8)
PWM_2: RN2.7 U10.40(PC9)
PWM_3: RN2.6 U10.39(PC8)
PWM_4: RN2.5 U10.36(PB15)
PWM_5: U10.30(PB11)
PWM_6: U10.29(PB10)
PWM_7: U10.55(PB3(JTDOTRACESWO))
PWM_8: U10.50(PA15(JTDI))
PWM_9: U10.35(PB14)
PWM_10: U10.22(PA6)
PWM_11: U10.58(PB6)
PWM_12: U10.27(PB1)
RSSI_ADC_PIN: U10.26(PB0)
SBUS: CN9.6 Q1.1(B)
SDCARD_CS: U10.9(PC1) U11.1(CS#)
SENS_CUR1: U10.25(PC5)
SENS_VOL: R2.1 R3.2 U10.24(PC4)
SPI1_IMU1_CS: U5.22(nCS) U10.3(PC14-OSC32_IN(PC14))
SPI1_MISO: U4.11(SDOUT) U5.9(SDO/AD0) U10.56(PB4(NJTRST))
SPI1_MOSI: U4.9(SDIN) U5.24(SDA/SDI) U10.23(PA7)
SPI1_OSD_CS: R29.1 U4.8(CS#) U10.33(PB12)
SPI1_SCLK: U4.10(SCLK) U5.23(SCL/SCLK) U10.21(PA5)
SPI2_MISO: U10.10(PC2) U11.2(DO(IO1))
SPI2_MOSI: U10.11(PC3) U11.5(DI(IO0))
SPI2_SCLK: U10.34(PB13) U11.6(CLK)
UART1_RX: CN1.3 U10.43(PA10)
UART1_TX: CN1.4 U10.42(PA9)
UART2_RX: CN3.1 U10.17(PA3)
UART2_TX: CN3.2 U10.16(PA2)
UART3_RX: CN9.4 U10.52(PC11)
UART3_TX: CN2.2 CN9.3 U10.51(PC10)
UART4_RX: CN6.1 U10.15(PA1)
UART4_TX: CN6.2 U10.14(PA0-WKUP(PA0))
UART5_RX: CN7.1 Q1.3(C) R6.2 U10.54(PD2)
UART5_TX: CN7.2 U10.53(PC12)
UART6_RX: CN10.2 U10.38(PC7)
UART6_TX: CN10.1 U10.37(PC6)
VCAP1: C22.1 U10.31(VCAP_1)
VCAP2: C23.1 U10.47(VCAP_2)
VIDIN: C41.1 U4.22(VIN)
VTX: CN2.1 R30.2
$1N953: LED1.4(R) R15.2
$1N1962: C38.2 C39.2 R30.1
$1N3098: C29.2 U5.10(REGOUT)
$1N3690: R22.2 U6.5(SDO)
$1N5313: R5.2 U3.8(PG)
$1N5318: R18.2 R19.1 R21.2
$1N5320: R8.2 U3.3(EN/SYNC)
$1N5321: C21.1 U3.4(BST)
$1N5322: C13.2 R5.1 U3.2(VCC)
$1N5325: C21.2 R10.2
$1N5344: R4.2 U2.8(PG)
$1N5352: R16.2 R17.1 R20.2
$1N5360: R7.2 U2.3(EN/SYNC)
$1N5361: C12.2 R4.1 U2.2(VCC)
$1N5362: C20.1 U2.4(BST)
$1N5363: C20.2 R9.2
$1N5613: R23.2 USB1.A8(SBU1)
$1N5614: R24.2 USB1.B8(SBU2)
$1N20077: RN2.4 U8.2
$1N20079: RN2.3 U8.3
$1N20081: RN2.2 U8.4
$1N20083: RN2.1 U8.5
$1N22853: LED1.3(G) R11.2
$1N22855: LED1.2(B) R14.2

Not connected (* = marked no-connect by the designer): U1 4(NC)*; U4 1(NC)* 2(NC)* 7(CLKOUT)* 13(SYNC_IN)* 14(NC)* 15(NC)* 16(NC)* 27(NC)* 28(NC)*; U5 1(NC)* 2(NC)* 3(NC)* 4(NC)* 5(NC)* 6(NC)* 7(AUX_CL)* 11(FSYNC)* 14(NC)* 15(NC)* 16(NC)* 17(NC)* 19(RESV)* 21(AUX_DA)*; U6 2(CSB)*; U8 6 7; U10 2(PC13)* 4(PC15-OSC32_OUT(PC15))* 8(PC0)* 28(PB2-BOOT1(PB2))*; U11 9(EP); USB1 A5(CC1) B5(CC2)

## Notes on the sheet
- BEC：主控供电3.3V
- BEC：5V外设供电
- BEC：9V外设供电
- IMU1：MPU6500
- VTX_焊盘
- RECV_4Pin
- ESC1_电调8Pin
- DJI_6Pin
